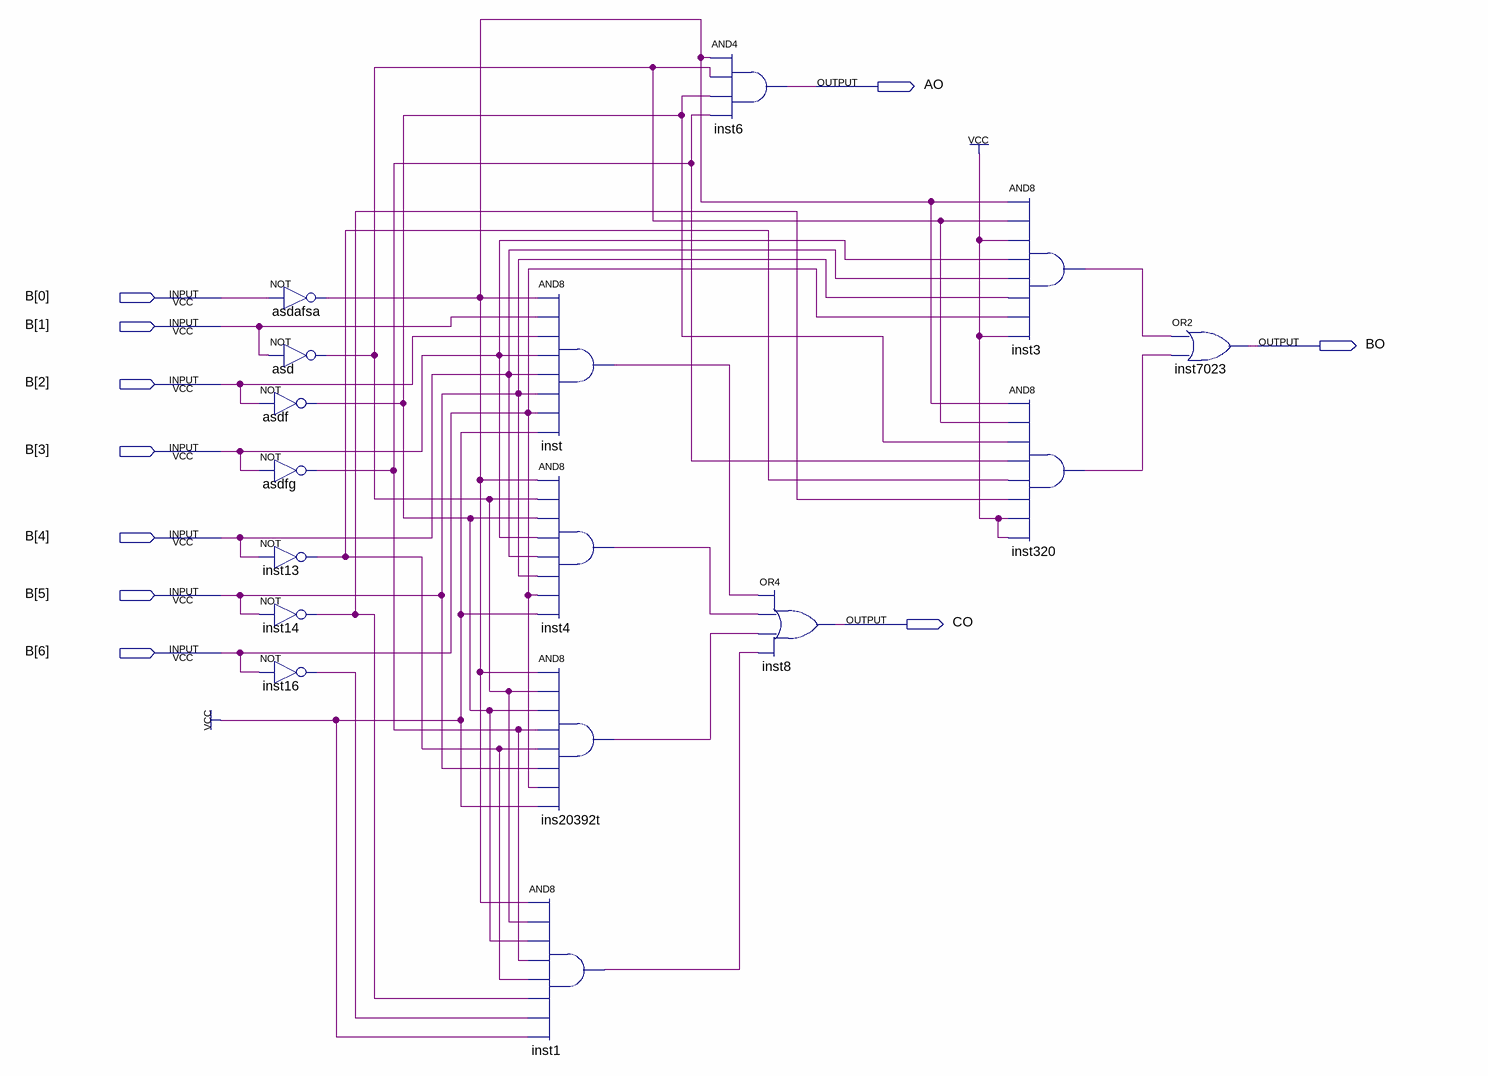
[diagram p0: schematic sheet]
// Quartus schematic CodificadorPriori.bdf as structural Verilog: 16 symbols, 10 pins
module CodificadorPriori (
  input  [6:0] B,
  output AO,
  output BO,
  output CO
);

  wire asd_out, asdafsa_out, asdf_out, asdfg_out, ins20392t_out, inst1_out, inst3_out, inst4_out, inst13_out,
       inst14_out, inst16_out, inst320_out, inst_out;

  not asdafsa (asdafsa_out, B[0]);
  not asd (asd_out, B[1]);
  not asdf (asdf_out, B[2]);
  not asdfg (asdfg_out, B[3]);
  not inst13 (inst13_out, B[4]);
  not inst14 (inst14_out, B[5]);
  not inst16 (inst16_out, B[6]);
  and inst (inst_out, asdafsa_out, B[1], B[2], B[3], B[4], B[5], B[6], 1'b1);
  and inst4 (inst4_out, asdafsa_out, asd_out, asdf_out, B[3], B[4], B[5], B[6], 1'b1);
  and ins20392t (ins20392t_out, asdafsa_out, asd_out, asdf_out, asdfg_out, inst13_out, B[5], B[6], 1'b1);
  and inst1 (inst1_out, asdafsa_out, asd_out, asdf_out, asdfg_out, inst13_out, inst14_out, inst16_out, 1'b1);
  and inst6 (AO, asdafsa_out, asd_out, asdf_out, asdfg_out);
  or inst8 (CO, inst_out, inst4_out, ins20392t_out, inst1_out);
  and inst3 (inst3_out, asdafsa_out, asd_out, 1'b1, B[3], B[4], B[5], B[6], 1'b1);
  and inst320 (inst320_out, asdafsa_out, asd_out, asdf_out, asdfg_out, inst13_out, inst14_out, 1'b1, 1'b1);
  or inst7023 (BO, inst3_out, inst320_out);
endmodule
